# Altium schematic sheet SelfDrivingCar_Power_Diagram.SchDoc
size A; DocumentNumber: 3; SheetNumber: 2; SheetTotal: 7
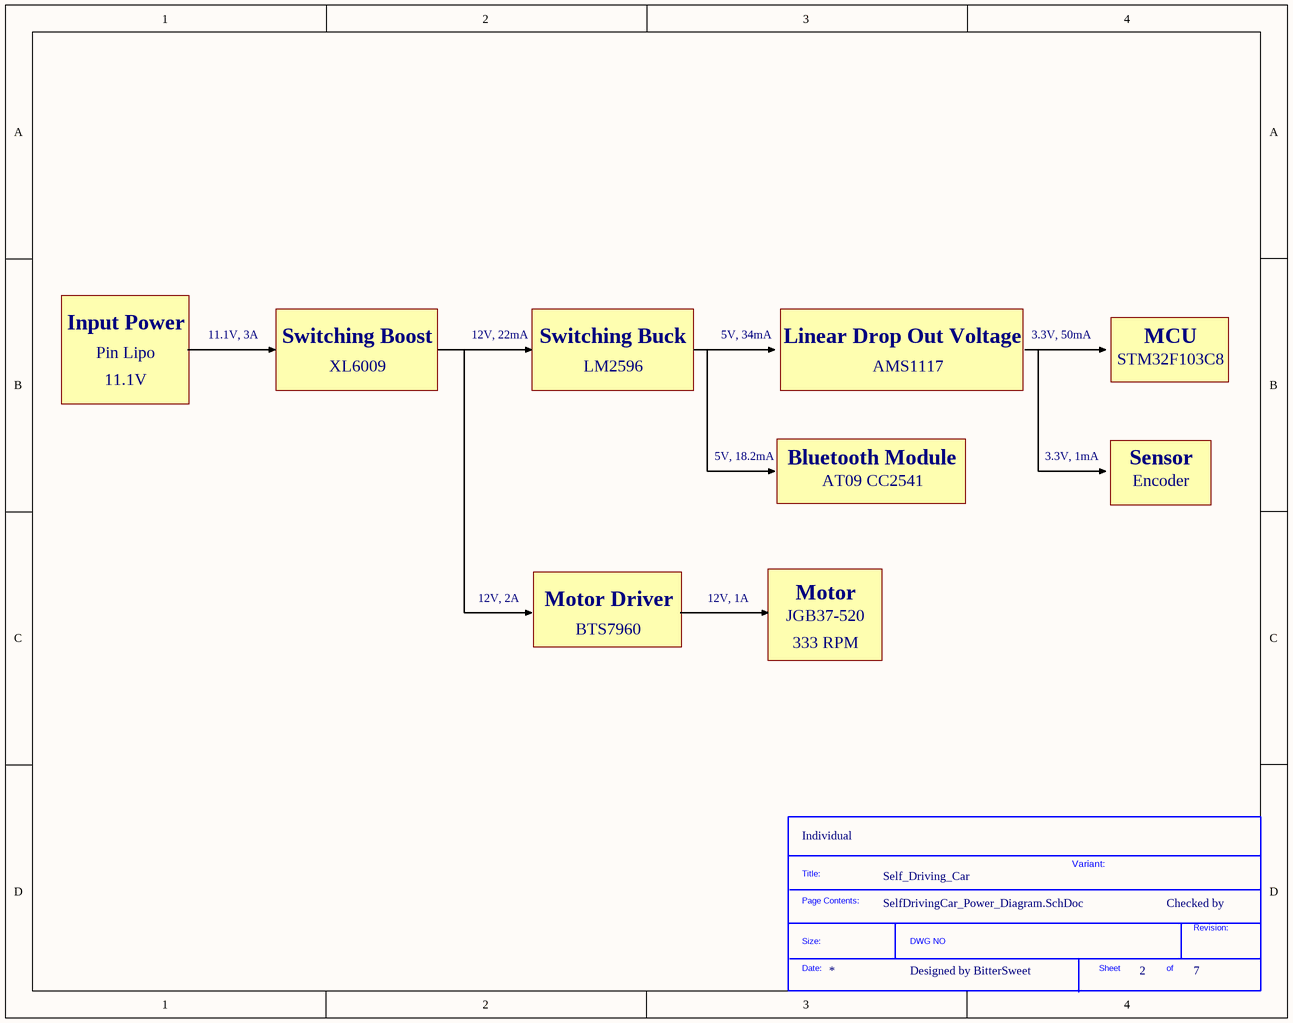
[diagram p0: SelfDrivingCar_Power_Diagram.SchDoc]

## Parts
*?  SDTitleBlock  (value not drawn)  (graphical)

## Notes on the sheet
- Input Power
- Pin Lipo
- 11.1V, 3A
- Switching Boost
- XL6009
- 12V, 22mA
- Switching Buck
- LM2596
- 5V, 34mA
- Linear Drop Out Voltage
- AMS1117
- 3.3V, 50mA
- STM32F103C8
- MCU
- 11.1V
- 5V, 18.2mA
- Bluetooth Module
- AT09 CC2541
- 3.3V, 1mA
- Sensor
- Encoder
- 12V, 2A
- Motor Driver
- BTS7960
- 12V, 1A
- JGB37-520
- Motor
- 333 RPM
- (near *?) Individual
- Self_Driving_Car
- Variant:
- Checked by
- Designed by BitterSweet
- (in symbol SDTitleBlock) Title:; Page Contents:; Revision:; Size:; DWG NO; Date:; Sheet; of